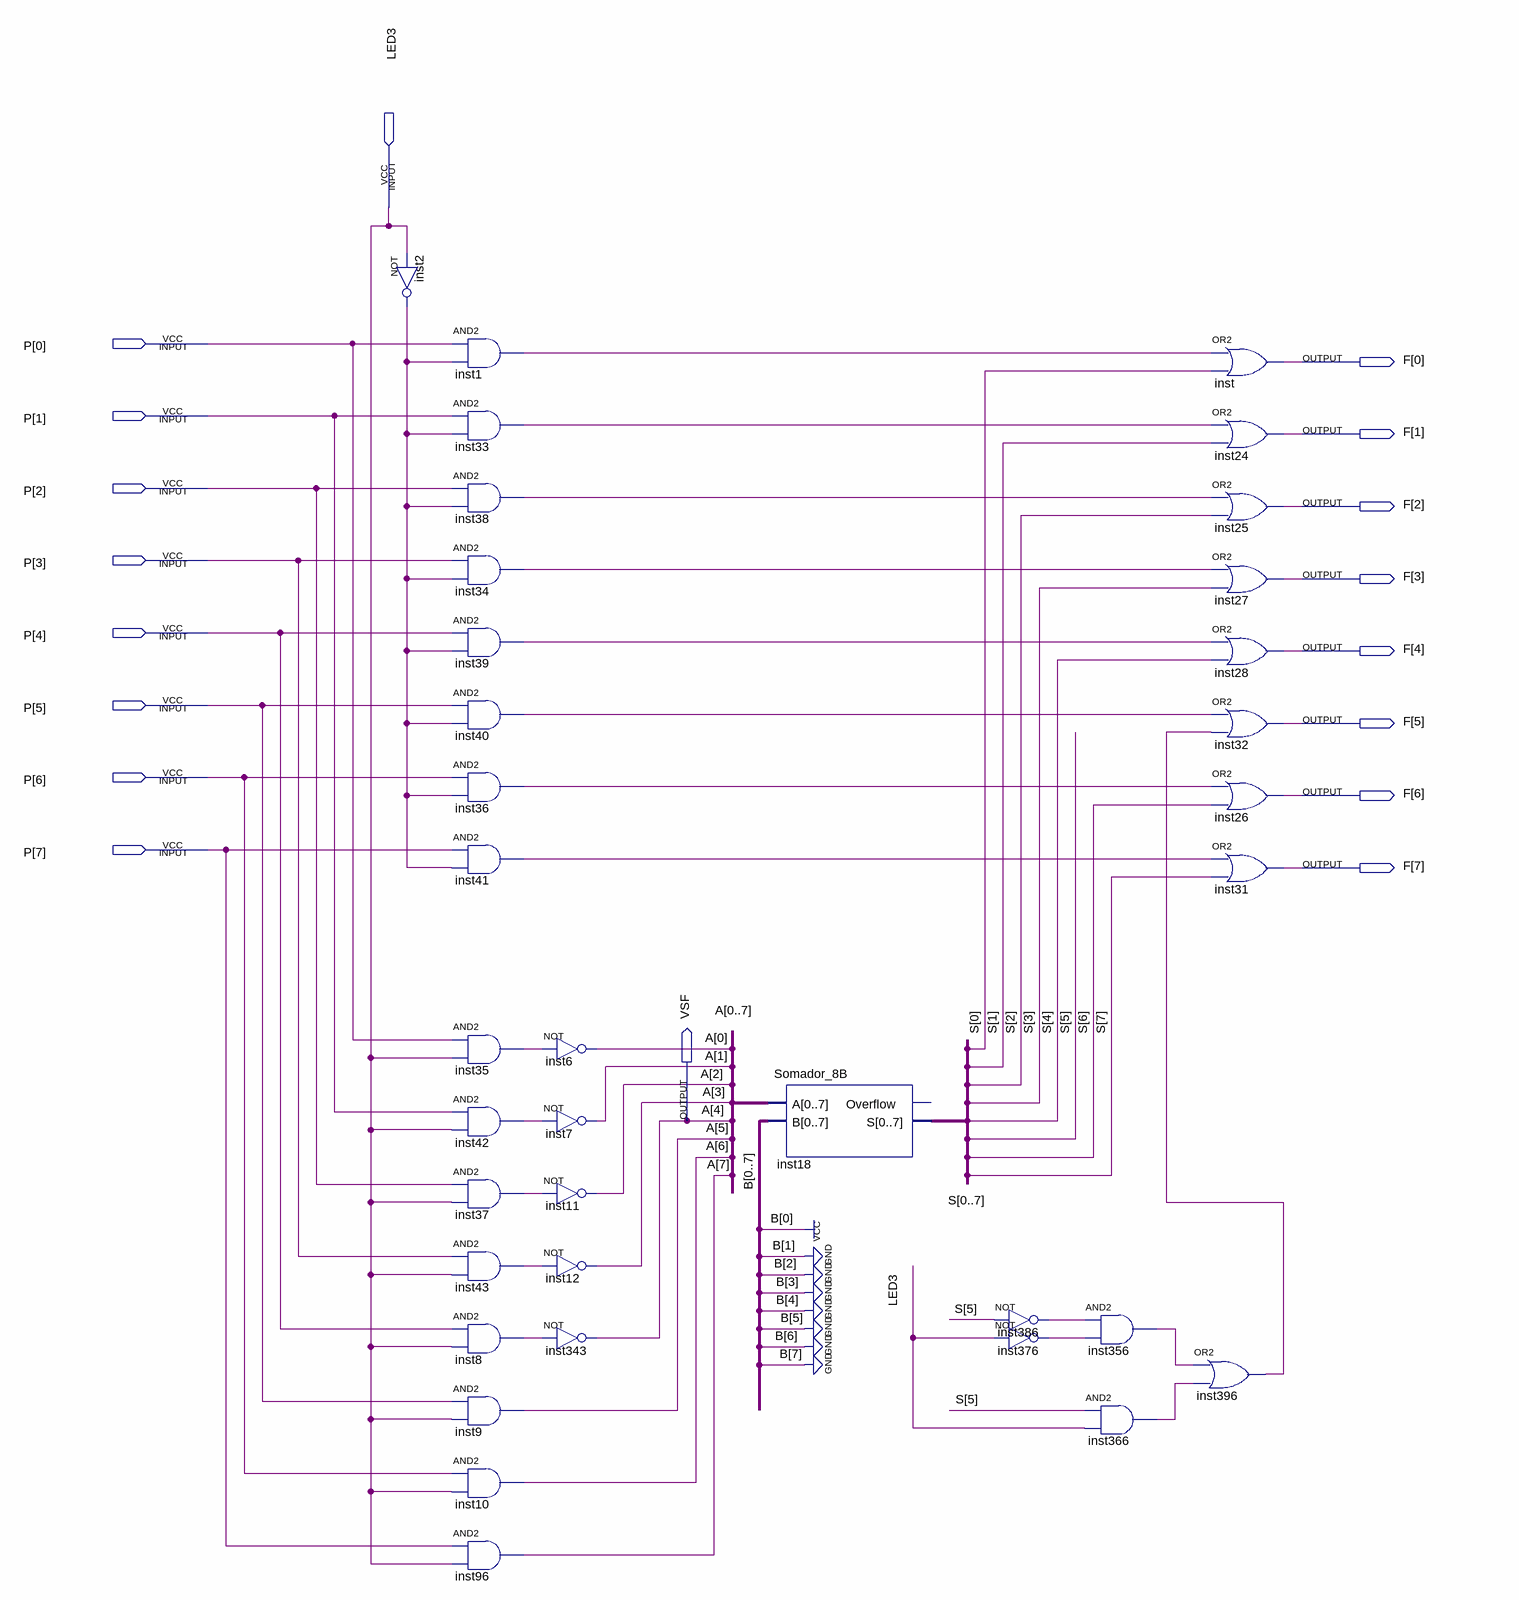
[diagram p0: schematic sheet]
// Quartus schematic ADAPTADOR.bdf as structural Verilog: 36 symbols, 18 pins
module ADAPTADOR (
  input  LED3,
  input  [7:0] P,
  output [7:0] F,
  output VSF
);

  wire inst1_out, inst2_out, inst8_out, inst33_out, inst34_out, inst35_out, inst36_out, inst37_out,
       inst38_out, inst39_out, inst40_out, inst41_out, inst42_out, inst43_out, inst356_out, inst366_out,
       inst376_out, inst386_out, inst396_out;
  wire [7:0] A, S;

  not inst2 (inst2_out, LED3);
  and inst1 (inst1_out, P[0], inst2_out);
  and inst33 (inst33_out, P[1], inst2_out);
  and inst38 (inst38_out, P[2], inst2_out);
  and inst34 (inst34_out, P[3], inst2_out);
  and inst39 (inst39_out, P[4], inst2_out);
  and inst40 (inst40_out, P[5], inst2_out);
  and inst36 (inst36_out, P[6], inst2_out);
  and inst41 (inst41_out, P[7], inst2_out);
  and inst35 (inst35_out, P[0], LED3);
  and inst42 (inst42_out, P[1], LED3);
  and inst37 (inst37_out, P[2], LED3);
  and inst43 (inst43_out, P[3], LED3);
  and inst8 (inst8_out, P[4], LED3);
  and inst9 (A[5], P[5], LED3);
  and inst10 (A[6], P[6], LED3);
  and inst96 (A[7], P[7], LED3);
  not inst6 (A[0], inst35_out);
  not inst7 (A[1], inst42_out);
  not inst11 (A[2], inst37_out);
  not inst12 (A[3], inst43_out);
  not inst343 (VSF, inst8_out);
  Somador_8B inst18 (
    .A({A[0], A[1], A[2], A[3], VSF, A[5], A[6], A[7]}), .B(8'b10000000),
    .S({S[0], S[1], S[2], S[3], S[4], S[5], S[6], S[7]}));  // open: Overflow
  not inst386 (inst386_out, S[5]);
  not inst376 (inst376_out, LED3);
  and inst356 (inst356_out, inst386_out, inst376_out);
  and inst366 (inst366_out, S[5], LED3);
  or inst (F[0], inst1_out, S[0]);
  or inst24 (F[1], inst33_out, S[1]);
  or inst25 (F[2], inst38_out, S[2]);
  or inst27 (F[3], inst34_out, S[3]);
  or inst28 (F[4], inst39_out, S[4]);
  or inst32 (F[5], inst40_out, inst396_out);
  or inst26 (F[6], inst36_out, S[6]);
  or inst31 (F[7], inst41_out, S[7]);
  or inst396 (inst396_out, inst356_out, inst366_out);

  // Other names for the same wires on the sheet: A[4] = VSF
endmodule
